# Altium project Power_Amplifier_PCB.PrjPcb
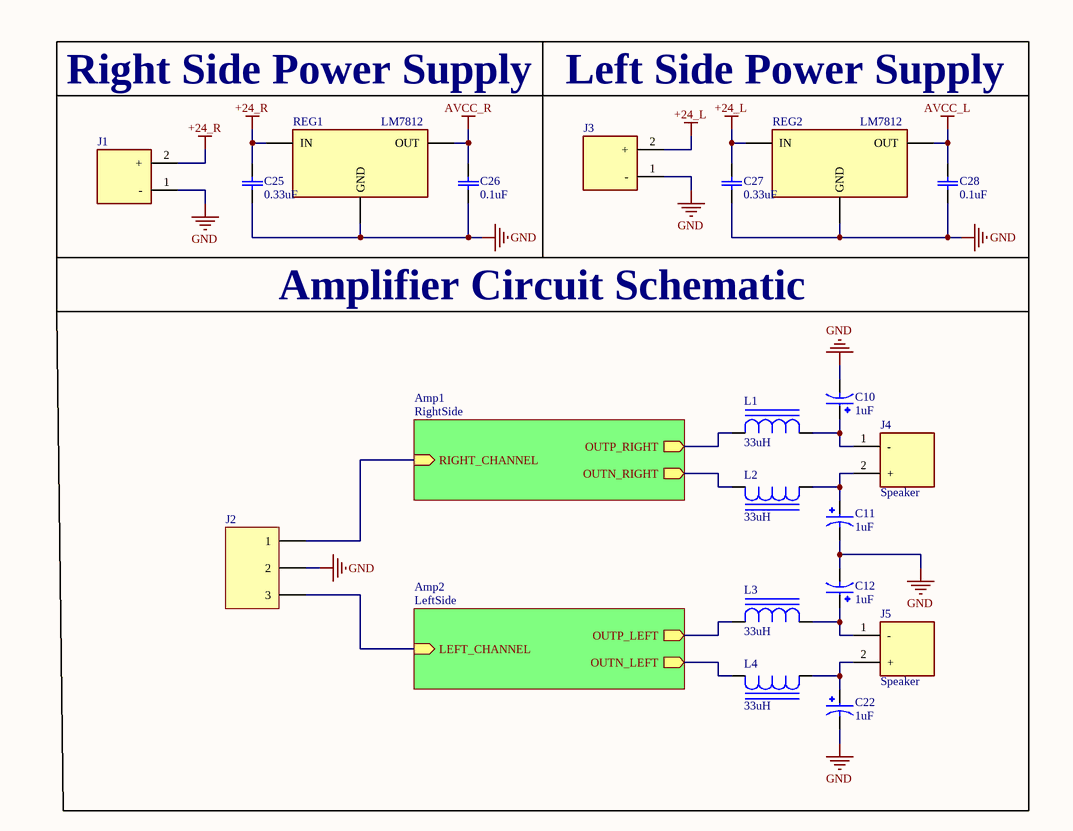
[diagram p0: Schematic.SchDoc]
3 sheets, 55 parts. Net scope: hierarchical (ports join the sheet entries above them; power ports are global).
Board file: PCB.PcbDoc
Sheets:
  Schematic.SchDoc
    Amp1 = RightSide.SchDoc
    Amp2 = LeftSide.SchDoc

## Sheet Schematic.SchDoc
size A4; SheetNumber: 1; SheetTotal: 3

### Parts
C10  1uF  [CAPRADIAL_16X10]
C11  1uF  [CAPRADIAL_16X10]
C12  1uF  [CAPRADIAL_16X10]
C22  1uF  [CAPRADIAL_16X10]
C25  0.33uF  [CERAMIC0805]
C26  0.1uF  [CERAMIC0805]
C27  0.33uF  [CERAMIC0805]
C28  0.1uF  [CERAMIC0805]
J1  Borne KF301-2P  [Borne KF301-2P]  (value not drawn)
J2  Borne KF301-3P  [Borne KF301-3P]  (value not drawn)
J3  Borne KF301-2P  [Borne KF301-2P]  (value not drawn)
J4  Speaker  [Borne KF301-2P]
J5  Speaker  [Borne KF301-2P]
L1  33uH  [DR124]
L2  33uH  [DR124]
L3  33uH  [DR124]
L4  33uH  [DR124]
REG1  LM7812  [TO-220-3]
REG2  LM7812  [TO-220-3]

### Sub-sheets
Amp1 = RightSide: RIGHT_CHANNEL (in), OUTP_RIGHT (out), OUTN_RIGHT (out)
Amp2 = LeftSide: LEFT_CHANNEL (in), OUTP_LEFT (out), OUTN_LEFT (out)

### Nets
+24_L: C27.2(C2) J3.2(+) REG2.1(IN)
+24_R: C25.2(C2) J1.2(+) REG1.1(IN)
AVCC_L: C28.2(C2) REG2.3(OUT)
AVCC_R: C26.2(C2) REG1.3(OUT)
GND: C10.N C11.N C12.N C22.N C25.1(C1) C26.1(C1) C27.1(C1) C28.1(C1) J1.1(-) J2.2 J3.1(-) REG1.2(GND) REG2.2(GND)
NetC5_2: L2.2 ; sheet Amp1/OUTN_RIGHT
NetC7_2: L1.1 ; sheet Amp1/OUTP_RIGHT
NetC9_1: J2.1 ; sheet Amp1/RIGHT_CHANNEL
NetC10_P: C10.P J4.1(-) L1.2
NetC11_P: C11.P J4.2(+) L2.1
NetC12_P: C12.P J5.1(-) L3.2
NetC17_2: L4.2 ; sheet Amp2/OUTN_LEFT
NetC19_2: L3.1 ; sheet Amp2/OUTP_LEFT
NetC21_1: J2.3 ; sheet Amp2/LEFT_CHANNEL
NetC22_P: C22.P J5.2(+) L4.1

### Notes on the sheet
- Right Side Power Supply
- Left Side Power Supply
- Amplifier Circuit Schematic

### Library data of the parts
C10-C12 C22 = CAP ELETRO/TANT: MP: EEU-EE2W560; MF: Panasonic; Digi-Key_Part_Number: P13679-ND; Check_prices: https://www.snapeda.com/parts/EEU-EE2W560/Panasonic/view-part/2337485/?ref=eda; Value: *; SnapEDA_Link: https://www.snapeda.com/parts/EEU-EE2W560/Panasonic/view-part/2337485/?ref=snap; Purchase-URL: https://pricing.snapeda.com/search/part/EEU-EE2W560/?ref=eda; Package: RADIAL-2 Panasonic
C25-C28 = Cap: MF: KEMET; MP: TAJC226M025RNJ; SnapEDA_Link: https://www.snapeda.com/parts/TAJC226M025RNJ/KEMET/view-part/?ref=snap; Availability: In Stock; Price: None; Purchase-URL: https://pricing.snapeda.com/search/part/TAJC226M025RNJ/?ref=eda; Package: None; Check_prices: https://www.snapeda.com/parts/TAJC226M025RNJ/KEMET/view-part/?ref=eda; Value: *
J1 J3-J5 = Borne KF301-2P: 2 Pin Terminal Block 5mm Pitch; Price: None; Value: *; MP: KF301-2P; Package: None; Availability: Unavailable
L1-L4 = Inductor
REG1 REG2 = LM78XX: Regulador de tensão linha LM78XX; MP: LM7805S/NOPB; MF: Texas Instruments; Check_prices: https://www.snapeda.com/parts/LM7805S/NOPB/Texas+Instruments/view-part/?ref=eda; Value: *; Availability: In Stock; Price: None; Package: TO-263-3 Texas Instruments; SnapEDA_Link: https://www.snapeda.com/parts/LM7805S/NOPB/Texas+Instruments/view-part/?ref=snap; Purchase-URL: https://pricing.snapeda.com/search/part/LM7805S/NOPB/?ref=eda

## Sheet RightSide.SchDoc
size A4; SheetNumber: 2; SheetTotal: 3
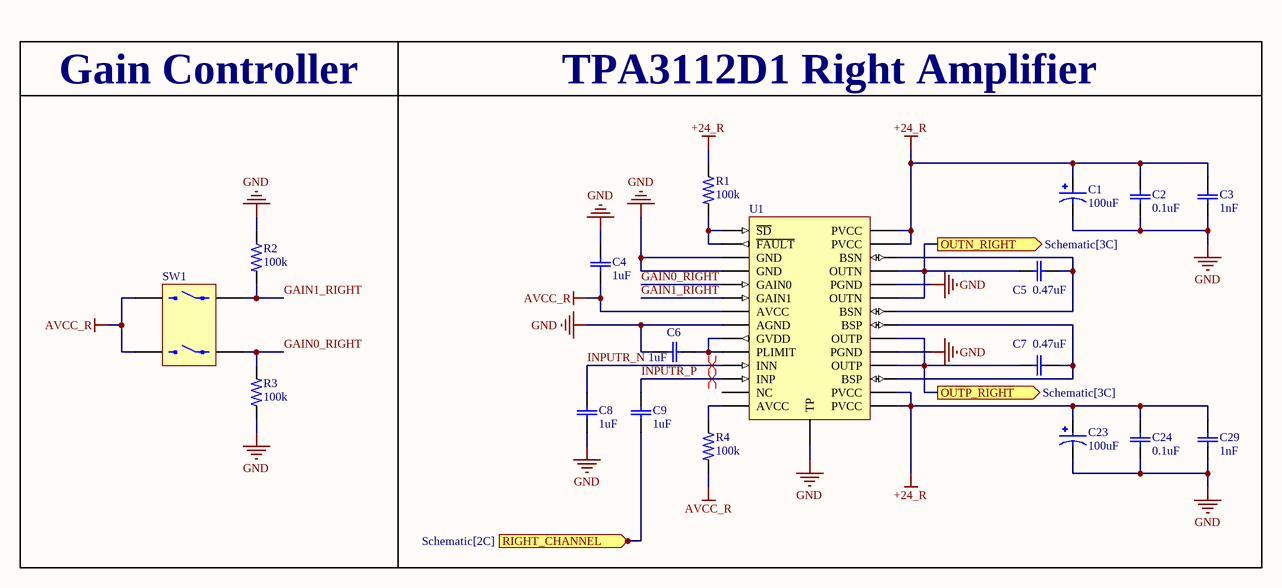
[diagram p1: RightSide.SchDoc]

### Parts
C1  100uF  [CAPRADIAL_16X10]
C2  0.1uF  [CERAMIC0805]
C3  1nF  [CERAMIC0603]
C4  1uF  [CERAMIC0603]
C5  0.47uF  [CERAMIC0603]
C6  1uF  [CERAMIC0603]
C7  0.47uF  [CERAMIC0603]
C8  1uF  [CERAMIC0603]
C9  1uF  [CERAMIC0603]
C23  100uF  [CAPRADIAL_16X10]
C24  0.1uF  [CERAMIC0805]
C29  1nF  [CERAMIC0603]
R1  100k  [RES0603]
R2  100k  [RES0603]
R3  100k  [RES0603]
R4  100k  [RES0603]
SW1  DIP SWITCH - 2 POS  [KF1001 - 2 POS]  (value not drawn)
U1  TPA3112D1  [HTSSOP-28]  (value not drawn)

### Ports
OUTN_RIGHT (out, see Schematic[3C]), OUTP_RIGHT (out, see Schematic[3C]), RIGHT_CHANNEL (in, see Schematic[2C])

### Nets
+24_R: C1.P C2.2(C2) C3.2(C2) C23.P C24.2(C2) C29.2(C2) R1.1 U1.15(PVCC) U1.16(PVCC) U1.27(PVCC) U1.28(PVCC)
AVCC_R: C4.2(C2) R4.2 SW1.2 SW1.3 U1.7(AVCC)
GND: C1.N C2.1(C1) C3.1(C1) C4.1(C1) C6.2(C2) C8.1(C1) C23.N C24.1(C1) C29.1(C1) R2.1 R3.1 U1.3(GND) U1.4(GND) U1.8(AGND) U1.19(PGND) U1.24(PGND) U1.29(TP)
GAIN0_RIGHT: R3.2 SW1.1 U1.5(GAIN0)
GAIN1_RIGHT: R2.2 SW1.4 U1.6(GAIN1)
INPUTR_N: C8.2(C2) U1.11(INN)
INPUTR_P: C9.2(C2) U1.12(INP)
NetC5_1: C5.1(C1) U1.22(BSN) U1.26(BSN)
NetC5_2: C5.2(C2) U1.23(OUTN) U1.25(OUTN) ; port OUTN_RIGHT
NetC6_1: C6.1(C1) U1.9(GVDD) U1.10(PLIMIT)
NetC7_1: C7.1(C1) U1.17(BSP) U1.21(BSP)
NetC7_2: C7.2(C2) U1.18(OUTP) U1.20(OUTP) ; port OUTP_RIGHT
NetC9_1: C9.1(C1) ; port RIGHT_CHANNEL
NetR1_2: R1.2 U1.1(~{SD}) U1.2(~{FAULT})
NetR4_1: R4.1 U1.14(AVCC)

Not connected (* = marked no-connect by the designer): U1 13(NC)

### Layout directives
differential pair: INPUTR_N, INPUTR_P

### Notes on the sheet
- Gain Controller
- TPA3112D1 Right Amplifier

### Library data of the parts
C1 C23 = CAP ELETRO/TANT: MP: EEU-EE2W560; MF: Panasonic; Digi-Key_Part_Number: P13679-ND; Check_prices: https://www.snapeda.com/parts/EEU-EE2W560/Panasonic/view-part/2337485/?ref=eda; Value: *; SnapEDA_Link: https://www.snapeda.com/parts/EEU-EE2W560/Panasonic/view-part/2337485/?ref=snap; Purchase-URL: https://pricing.snapeda.com/search/part/EEU-EE2W560/?ref=eda; Package: RADIAL-2 Panasonic
C2-C9 C24 C29 = Cap: MF: KEMET; MP: TAJC226M025RNJ; SnapEDA_Link: https://www.snapeda.com/parts/TAJC226M025RNJ/KEMET/view-part/?ref=snap; Availability: In Stock; Price: None; Purchase-URL: https://pricing.snapeda.com/search/part/TAJC226M025RNJ/?ref=eda; Package: None; Check_prices: https://www.snapeda.com/parts/TAJC226M025RNJ/KEMET/view-part/?ref=eda; Value: *
R1-R4 = RESISTOR SMD: MP: 3-1879460-6; Package: None; Price: None; Value: *; Availability: Unavailable
U1 = TPA3112D1: 25W Filter-Free Mono Class-D Audio Power Amplifier

## Sheet LeftSide.SchDoc
size A4; SheetNumber: 3; SheetTotal: 3
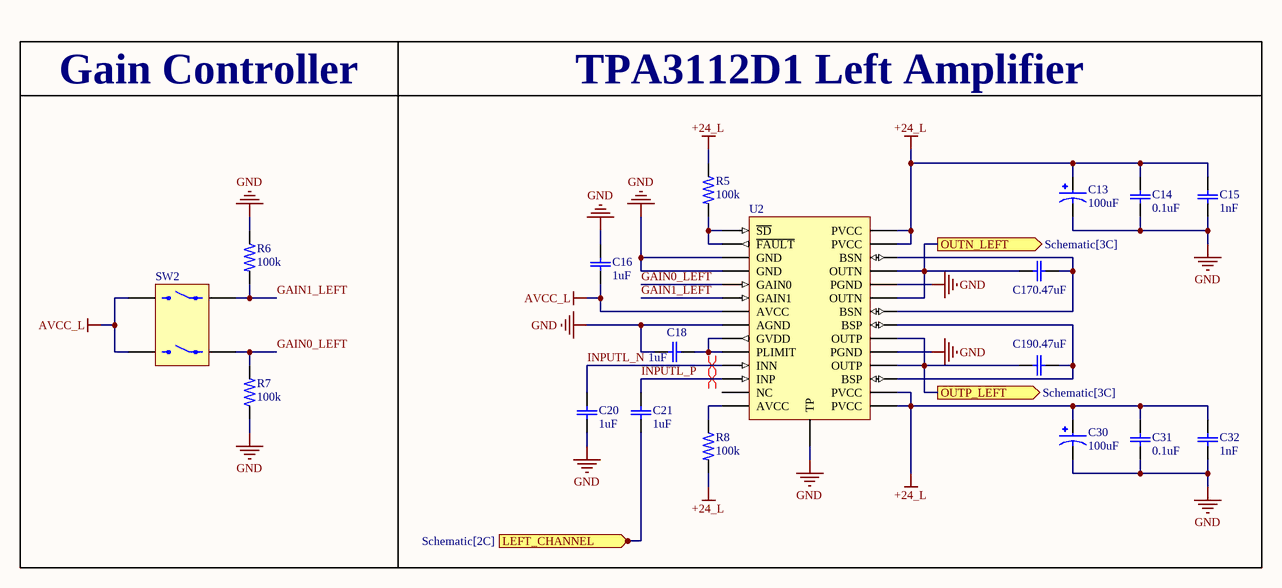
[diagram p2: LeftSide.SchDoc]

### Parts
C13  100uF  [CAPRADIAL_16X10]
C14  0.1uF  [CERAMIC0805]
C15  1nF  [CERAMIC0603]
C16  1uF  [CERAMIC0603]
C17  0.47uF  [CERAMIC0603]
C18  1uF  [CERAMIC0603]
C19  0.47uF  [CERAMIC0603]
C20  1uF  [CERAMIC0603]
C21  1uF  [CERAMIC0603]
C30  100uF  [CAPRADIAL_16X10]
C31  0.1uF  [CERAMIC0805]
C32  1nF  [CERAMIC0603]
R5  100k  [RES0603]
R6  100k  [RES0603]
R7  100k  [RES0603]
R8  100k  [RES0603]
SW2  DIP SWITCH - 2 POS  [KF1001 - 2 POS]  (value not drawn)
U2  TPA3112D1  [HTSSOP-28]  (value not drawn)

### Ports
LEFT_CHANNEL (in, see Schematic[2C]), OUTN_LEFT (out, see Schematic[3C]), OUTP_LEFT (out, see Schematic[3C])

### Nets
+24_L: C13.P C14.2(C2) C15.2(C2) C30.P C31.2(C2) C32.2(C2) R5.1 R8.2 U2.15(PVCC) U2.16(PVCC) U2.27(PVCC) U2.28(PVCC)
AVCC_L: C16.2(C2) SW2.2 SW2.3 U2.7(AVCC)
GND: C13.N C14.1(C1) C15.1(C1) C16.1(C1) C18.2(C2) C20.1(C1) C30.N C31.1(C1) C32.1(C1) R6.1 R7.1 U2.3(GND) U2.4(GND) U2.8(AGND) U2.19(PGND) U2.24(PGND) U2.29(TP)
GAIN0_LEFT: R7.2 SW2.1 U2.5(GAIN0)
GAIN1_LEFT: R6.2 SW2.4 U2.6(GAIN1)
INPUTL_N: C20.2(C2) U2.11(INN)
INPUTL_P: C21.2(C2) U2.12(INP)
NetC17_1: C17.1(C1) U2.22(BSN) U2.26(BSN)
NetC17_2: C17.2(C2) U2.23(OUTN) U2.25(OUTN) ; port OUTN_LEFT
NetC18_1: C18.1(C1) U2.9(GVDD) U2.10(PLIMIT)
NetC19_1: C19.1(C1) U2.17(BSP) U2.21(BSP)
NetC19_2: C19.2(C2) U2.18(OUTP) U2.20(OUTP) ; port OUTP_LEFT
NetC21_1: C21.1(C1) ; port LEFT_CHANNEL
NetR5_2: R5.2 U2.1(~{SD}) U2.2(~{FAULT})
NetR8_1: R8.1 U2.14(AVCC)

Not connected (* = marked no-connect by the designer): U2 13(NC)

### Layout directives
differential pair: INPUTL_N, INPUTL_P

### Notes on the sheet
- Gain Controller
- TPA3112D1 Left Amplifier

### Library data of the parts
C13 C30 = CAP ELETRO/TANT: MP: EEU-EE2W560; MF: Panasonic; Digi-Key_Part_Number: P13679-ND; Check_prices: https://www.snapeda.com/parts/EEU-EE2W560/Panasonic/view-part/2337485/?ref=eda; Value: *; SnapEDA_Link: https://www.snapeda.com/parts/EEU-EE2W560/Panasonic/view-part/2337485/?ref=snap; Purchase-URL: https://pricing.snapeda.com/search/part/EEU-EE2W560/?ref=eda; Package: RADIAL-2 Panasonic
C14-C21 C31 C32 = Cap: MF: KEMET; MP: TAJC226M025RNJ; SnapEDA_Link: https://www.snapeda.com/parts/TAJC226M025RNJ/KEMET/view-part/?ref=snap; Availability: In Stock; Price: None; Purchase-URL: https://pricing.snapeda.com/search/part/TAJC226M025RNJ/?ref=eda; Package: None; Check_prices: https://www.snapeda.com/parts/TAJC226M025RNJ/KEMET/view-part/?ref=eda; Value: *
R5-R8 = RESISTOR SMD: MP: 3-1879460-6; Package: None; Price: None; Value: *; Availability: Unavailable
U2 = TPA3112D1: as U1 on sheet RightSide

## Nets that join several sheets
+24_L: Schematic (C27.2 J3.2 REG2.1), LeftSide (12 pins)
+24_R: Schematic (C25.2 J1.2 REG1.1), RightSide (11 pins)
AVCC_L: Schematic (C28.2 REG2.3), LeftSide (C16.2 SW2.2 SW2.3 U2.7)
AVCC_R: Schematic (C26.2 REG1.3), RightSide (5 pins)
GND: Schematic (13 pins), RightSide (17 pins), LeftSide (17 pins)
NetC5_2: Schematic (L2.2), RightSide (C5.2 U1.23 U1.25)
NetC7_2: Schematic (L1.1), RightSide (C7.2 U1.18 U1.20)
NetC9_1: Schematic (J2.1), RightSide (C9.1)
NetC17_2: Schematic (L4.2), LeftSide (C17.2 U2.23 U2.25)
NetC19_2: Schematic (L3.1), LeftSide (C19.2 U2.18 U2.20)
NetC21_1: Schematic (J2.3), LeftSide (C21.1)